# Altium schematic sheet expansion.SchDoc
size A; SheetNumber: 1; SheetTotal: 1
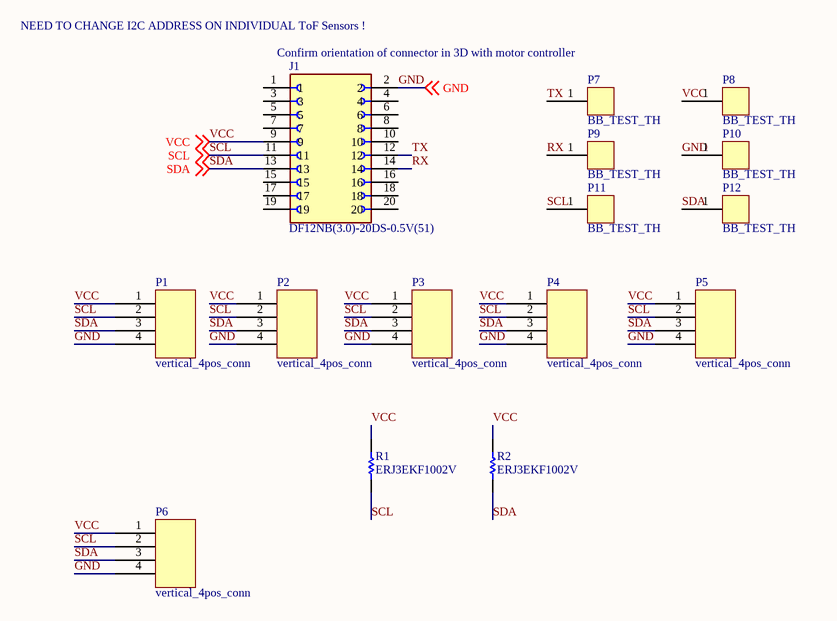
[diagram p0: expansion.SchDoc]

## Parts
J1  DF12NB(3.0)-20DS-0.5V(51)  [HRS_DF12NB(3.0)-20DS-0.5V(51)]
P1  vertical_4pos_conn  [vertical_4pos_conn _s_square]
P2  vertical_4pos_conn  [vertical_4pos_conn _s_square]
P3  vertical_4pos_conn  [vertical_4pos_conn _s_square]
P4  vertical_4pos_conn  [vertical_4pos_conn _s_square]
P5  vertical_4pos_conn  [vertical_4pos_conn _s_square]
P6  vertical_4pos_conn  [4pos_conn_tof]
P7  BB_TEST_TH  [BB_WIRE_TEST_TH]
P8  BB_TEST_TH  [BB_WIRE_TEST_TH]
P9  BB_TEST_TH  [BB_WIRE_TEST_TH]
P10  BB_TEST_TH  [BB_WIRE_TEST_TH]
P11  BB_TEST_TH  [BB_WIRE_TEST_TH]
P12  BB_TEST_TH  [BB_WIRE_TEST_TH]
R1  ERJ3EKF1002V  [RESC1609X55X30LL15T15]
R2  ERJ3EKF1002V  [RESC1609X55X30LL15T15]

## Nets
GND: J1.2 P1.4 P2.4 P3.4 P4.4 P5.4 P6.4 P10.1 ; off-sheet GND
RX: J1.14 P9.1
SCL: J1.11 P1.2 P2.2 P3.2 P4.2 P5.2 P6.2 P11.1 R1.1 ; off-sheet SCL
SDA: J1.13 P1.3 P2.3 P3.3 P4.3 P5.3 P6.3 P12.1 R2.1 ; off-sheet SDA
TX: J1.12 P7.1
VCC: J1.9 P1.1 P2.1 P3.1 P4.1 P5.1 P6.1 P8.1 R1.2 R2.2 ; off-sheet VCC

Not connected (* = marked no-connect by the designer): J1 1 3 4 5 6 7 8 10 15 16 17 18 19 20

## Notes on the sheet
- NEED TO CHANGE I2C ADDRESS ON INDIVIDUAL ToF Sensors !
- Confirm orientation of connector in 3D with motor controller

## Library data of the parts
R1 R2 = CMP-1012-00623-3: Chip Resistor, 10 KOhm, +/- 1%, 0.1 W, -55 to 155 degC, 0603 (1608 Metric), RoHS, Tape and Reel; Manufacturer: Panasonic; Voltage Rating: 75V; Case\/Package: 0603; Power Rating: 100mW; Resistance: 10KOhm; Temperature Coefficient: 100ppm\/degreesC; Number of Pins: 2; Package Reference: 603; Depth: 0.8mm; Mount: SurfaceMount; Package Description: 2-Pin Surface Mount Device, Body 1.6 x 0.85 mm; Datasheet Version: 02/2017; Length: 1.6mm; Lead Free: LeadFree; Height: 0.45mm; Number of Terminations: 2; Max Power Dissipation: 100mW; Min Operating Temperature: -55degC; Datasheet URL: https://industrial.panasonic.com/cdbs/www-data/pdf/RDA0000/AOA0000C304.pdf; Termination: SMD/SMT; Case Code (Metric): 1608; Case Code (Imperial): 0603; Tolerance: 1%; Max Operating Temperature: 155degC; RoHSCompliant: true; Voltage Rating (DC): 75V; Radiation Hardening: No; Packaging: TapeandReel; Composition: ThickFilm; Mounting Technology: SurfaceMount; Manufacturer URL: http://www.panasonic.com/; Width: 0.031inch; REACH SVHC: NoSVHC; Contact Plating: Tin; Military Standard: Not; Package Quantity: 1
J1 = DF12NB(3.0)-20DS-0.5V(51): Value: *; Availability: Unavailable; Package: None; Price: None; MP: DF12NB(3.0)-20DS-0.5V(51)